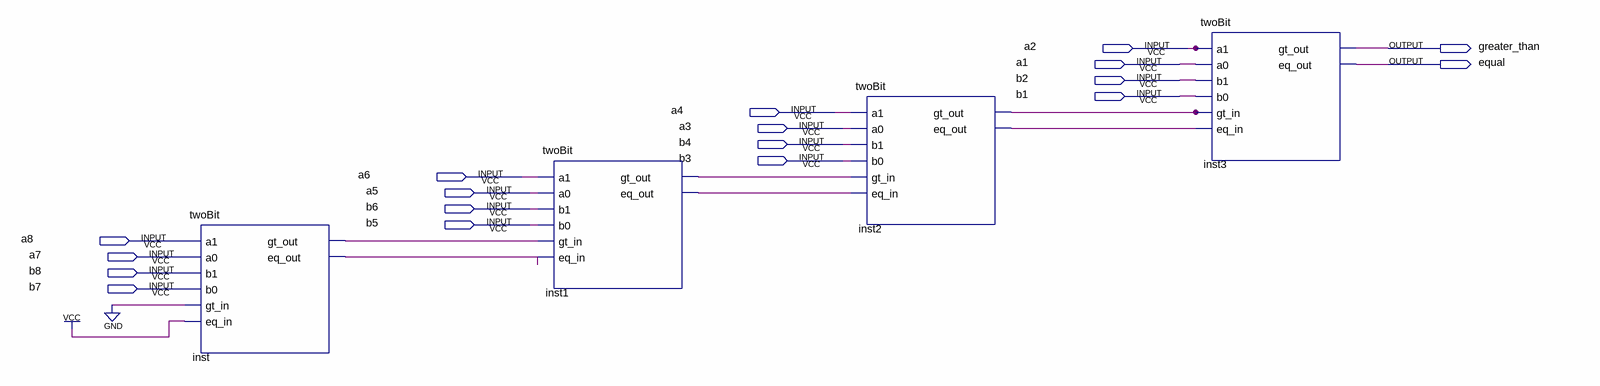
[diagram p0: schematic sheet]
// Quartus schematic eightBit.bdf as structural Verilog: 4 symbols, 18 pins
module eightBit (
  input  a2,
  input  a1,
  input  b2,
  input  b1,
  input  a4,
  input  a3,
  input  b4,
  input  b3,
  input  a6,
  input  a5,
  input  b6,
  input  b5,
  input  a8,
  input  a7,
  input  b8,
  input  b7,
  output greater_than,
  output equal
);

  wire inst1_eq_out, inst1_gt_out, inst2_eq_out, inst2_gt_out, inst_eq_out, inst_gt_out;

  twoBit inst (
    .a1(a8), .a0(a7), .b1(b8), .b0(b7), .gt_in(1'b0), .eq_in(1'b1), .gt_out(inst_gt_out), .eq_out(inst_eq_out));
  twoBit inst1 (
    .a1(a6), .a0(a5), .b1(b6), .b0(b5), .gt_in(inst_gt_out), .eq_in(inst_eq_out), .gt_out(inst1_gt_out),
    .eq_out(inst1_eq_out));
  twoBit inst2 (
    .a1(a4), .a0(a3), .b1(b4), .b0(b3), .gt_in(inst1_gt_out), .eq_in(inst1_eq_out), .gt_out(inst2_gt_out),
    .eq_out(inst2_eq_out));
  twoBit inst3 (
    .a1(a2), .a0(a1), .b1(b2), .b0(b1), .gt_in(inst2_gt_out), .eq_in(inst2_eq_out), .gt_out(greater_than),
    .eq_out(equal));
endmodule
